# Altium schematic sheet Sensors.SchDoc
size A
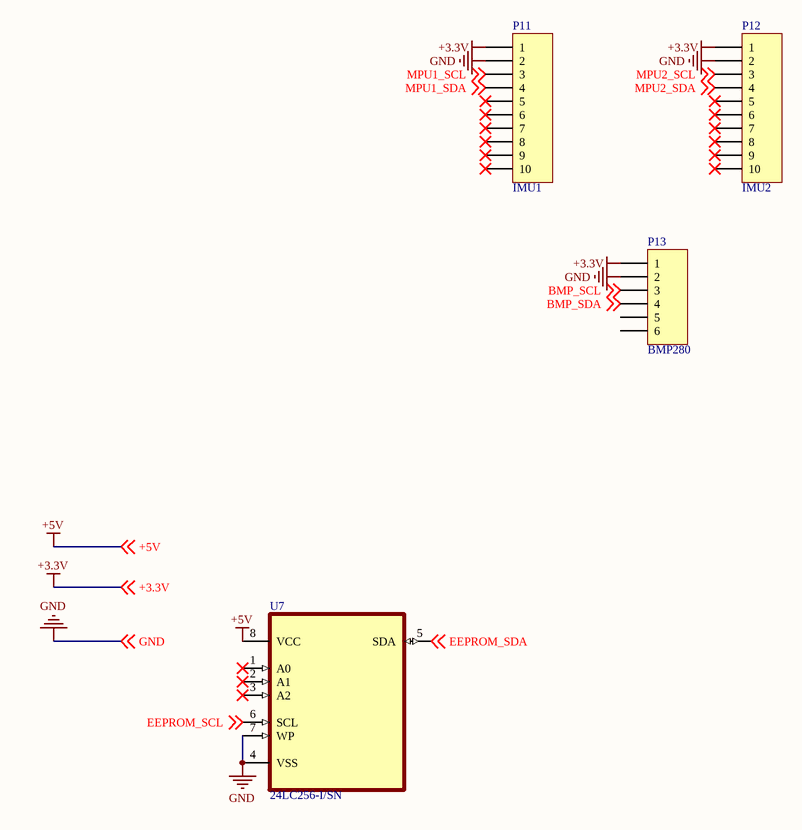
[diagram p0: Sensors.SchDoc]

## Parts
P11  IMU1  [HDR1X10]
P12  IMU2  [HDR1X10]
P13  BMP280  [HDR1X6]
U7  24LC256-I/SN  [SOIC127P600X175-8N]

## Nets
+3.3V: P11.1 P12.1 P13.1 ; off-sheet +3.3V
+5V: U7.8(VCC) ; off-sheet +5V
GND: P11.2 P12.2 P13.2 U7.4(VSS) U7.7(WP) ; off-sheet GND
BMP_SCL: P13.3 ; off-sheet BMP_SCL
BMP_SDA: P13.4 ; off-sheet BMP_SDA
EEPROM_SCL: U7.6(SCL) ; off-sheet EEPROM_SCL
EEPROM_SDA: U7.5(SDA) ; off-sheet EEPROM_SDA
MPU1_SCL: P11.3 ; off-sheet MPU1_SCL
MPU1_SDA: P11.4 ; off-sheet MPU1_SDA
MPU2_SCL: P12.3 ; off-sheet MPU2_SCL
MPU2_SDA: P12.4 ; off-sheet MPU2_SDA

Not connected (* = marked no-connect by the designer): P11 5* 6* 7* 8* 9* 10*; P12 5* 6* 7* 8* 9* 10*; P13 5 6; U7 1(A0)* 2(A1)* 3(A2)*

## Library data of the parts
P11 P12 = Header 10: Header, 10-Pin; LatestRevisionDate: 17-Jul-2002; LatestRevisionNote: Re-released for DXP Platform.; Publisher: Altium Limited
P13 = Header 6: Header, 6-Pin; LatestRevisionDate: 17-Jul-2002; LatestRevisionNote: Re-released for DXP Platform.; Publisher: Altium Limited
U7 = 24LC256-I/SN: EEPROM Memory IC 256Kb _32K x 8_ IÂ²C 400kHz 900ns 8-SOIC; MF: Microchip; Value: *; MP: 24LC256-I/SN; Package: SOIC-8 Microchip; SnapEDA_Link: https://www.snapeda.com/parts/24LC256-I/SN/Microchip/view-part/9771/?ref=snap; Price: None; Availability: Unavailable